# EAGLE schematic glowball (EAGLE 6.5.0)
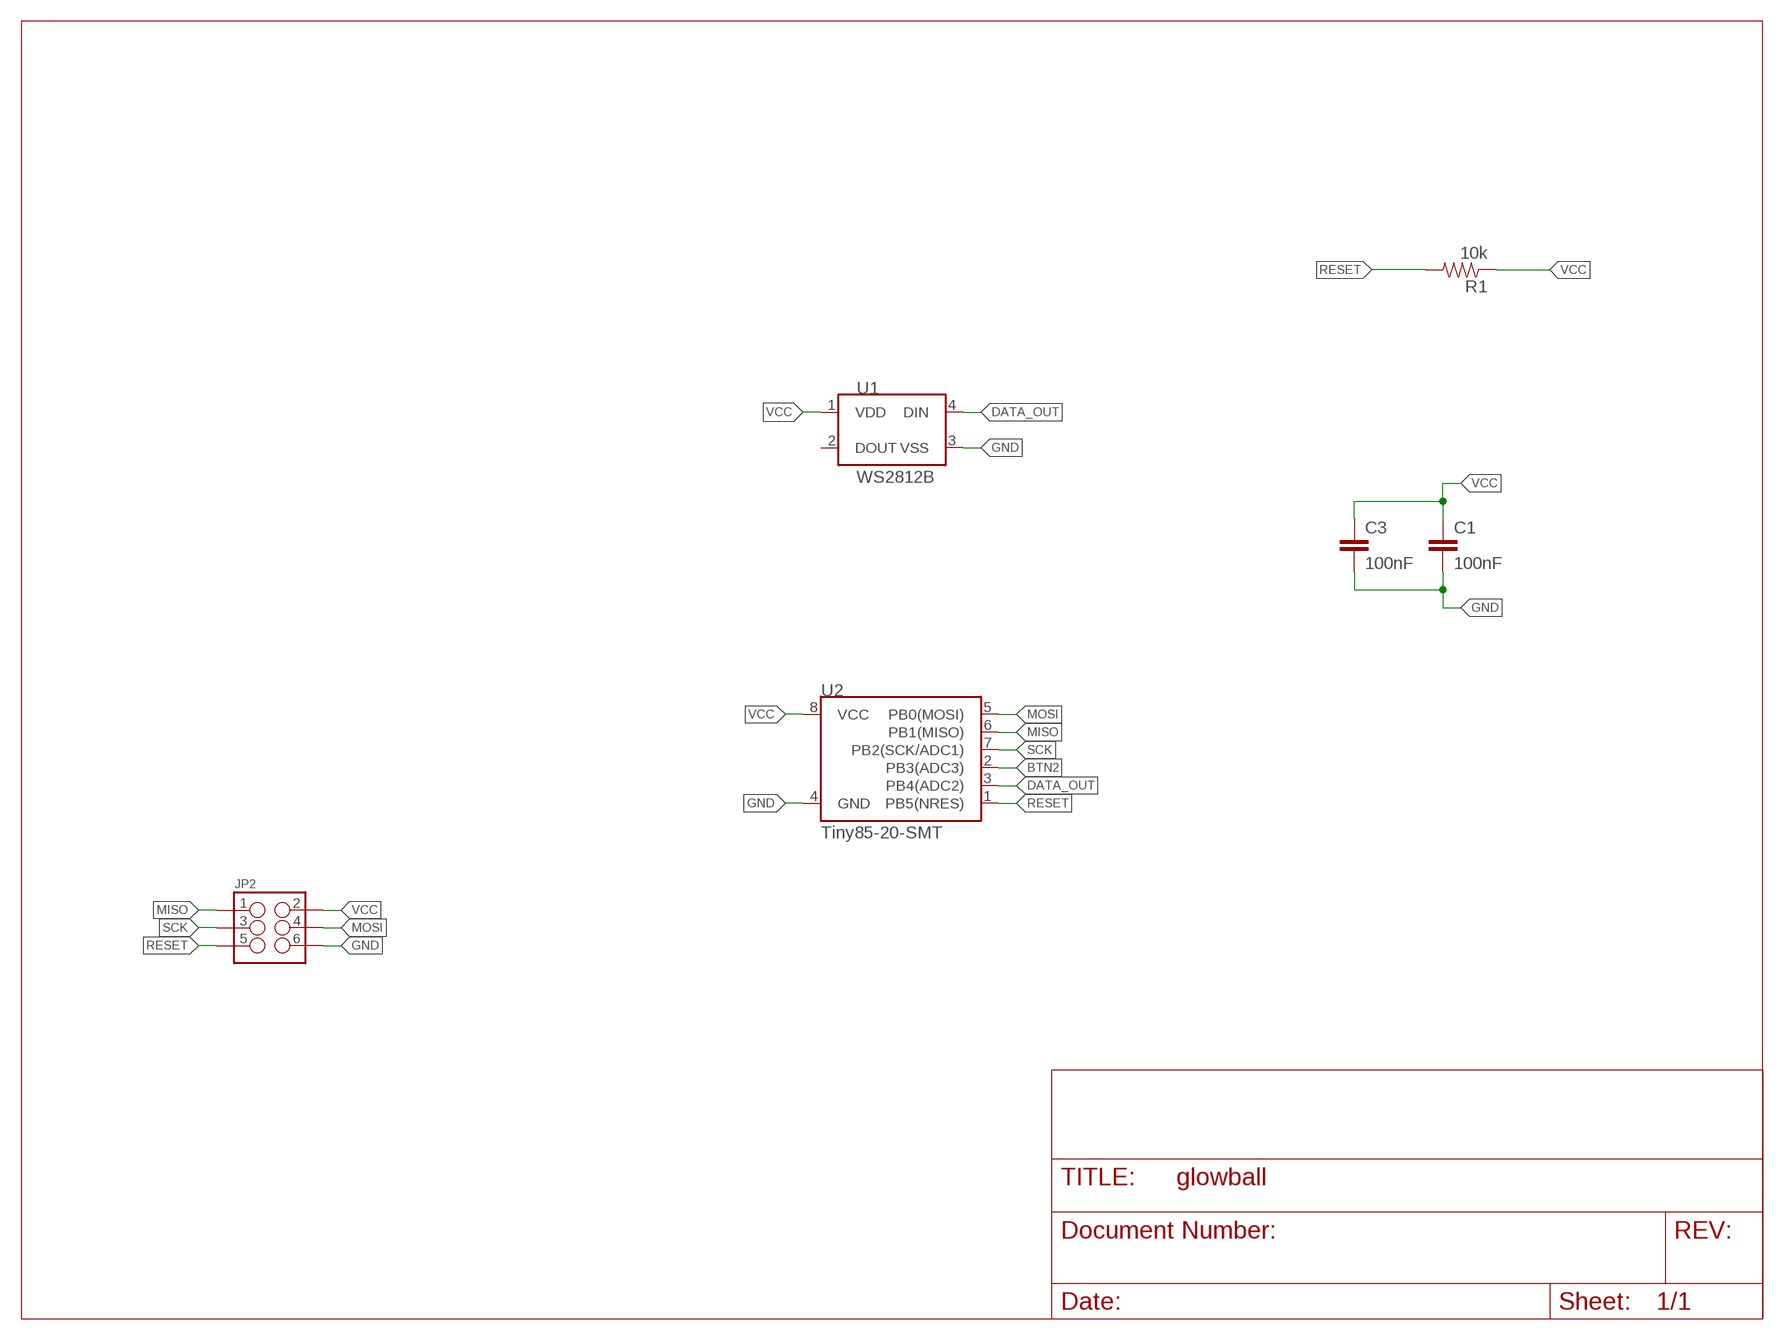
[diagram p0: schematic, sheet 1]

## Parts
C1  100nF  CAP0805  [0805]
C3  100nF  CAP0805  [0805]
JP2  M03X2  [2X3_SMD]
R1  10k  RESISTOR0805-RES  [0805]
U1  WS2812B  [WS2812B]
U2  Tiny85-20-SMT  ATTINY45TINY85-20-SMT  [SO08-EIAJ]

## Nets
BTN2: U2.2(PB3(ADC3))
DATA_OUT: U1.4(DIN) U2.3(PB4(ADC2))
GND: C1.2 C3.2 JP2.6 U1.3(VSS) U2.4(GND)
MISO: JP2.1 U2.6(PB1(MISO))
MOSI: JP2.4 U2.5(PB0(MOSI))
RESET: JP2.5 R1.2 U2.1(PB5(NRES))
SCK: JP2.3 U2.7(PB2(SCK/ADC1))
VCC: C1.1 C3.1 JP2.2 R1.1 U1.1(VDD) U2.8(VCC)
Unconnected: U1.2(DOUT)

## Library data of the parts
C1 C3 = SparkFun-Passives:CAP: Capacitor Standard 0603 ceramic capacitor, and 0.1" leaded capacitor.; PARTNO: C0805C104K8RACTU
JP2 = SparkFun-Connectors:M03X2: 2x3 .1" header. Shrouded, with keying- CONN-10681 SMT- CONN-11415 Pogo pins- HW-11044; PARTNO: M20-9980346; PROD_ID: CONN-11290
R1 = SparkFun-Passives:RESISTOR: Resistor Basic schematic elements and footprints for 0603, 1206, and PTH resistors.; PARTNO: RMCF0805FT10K0
U1 = my_parts:WS2812B
U2 = SparkFun-DigitalIC:ATTINY45: Atmel 8-pin 2/4/8kB flash uC; PARTNO: ATTINY85-20SUR; PROD_ID: IC-09092